# Altium schematic sheet Regulators.SchDoc
size Letter; ProjectTitle: Dan DfMux Mezz; ModelNumber: MGMEZZ04
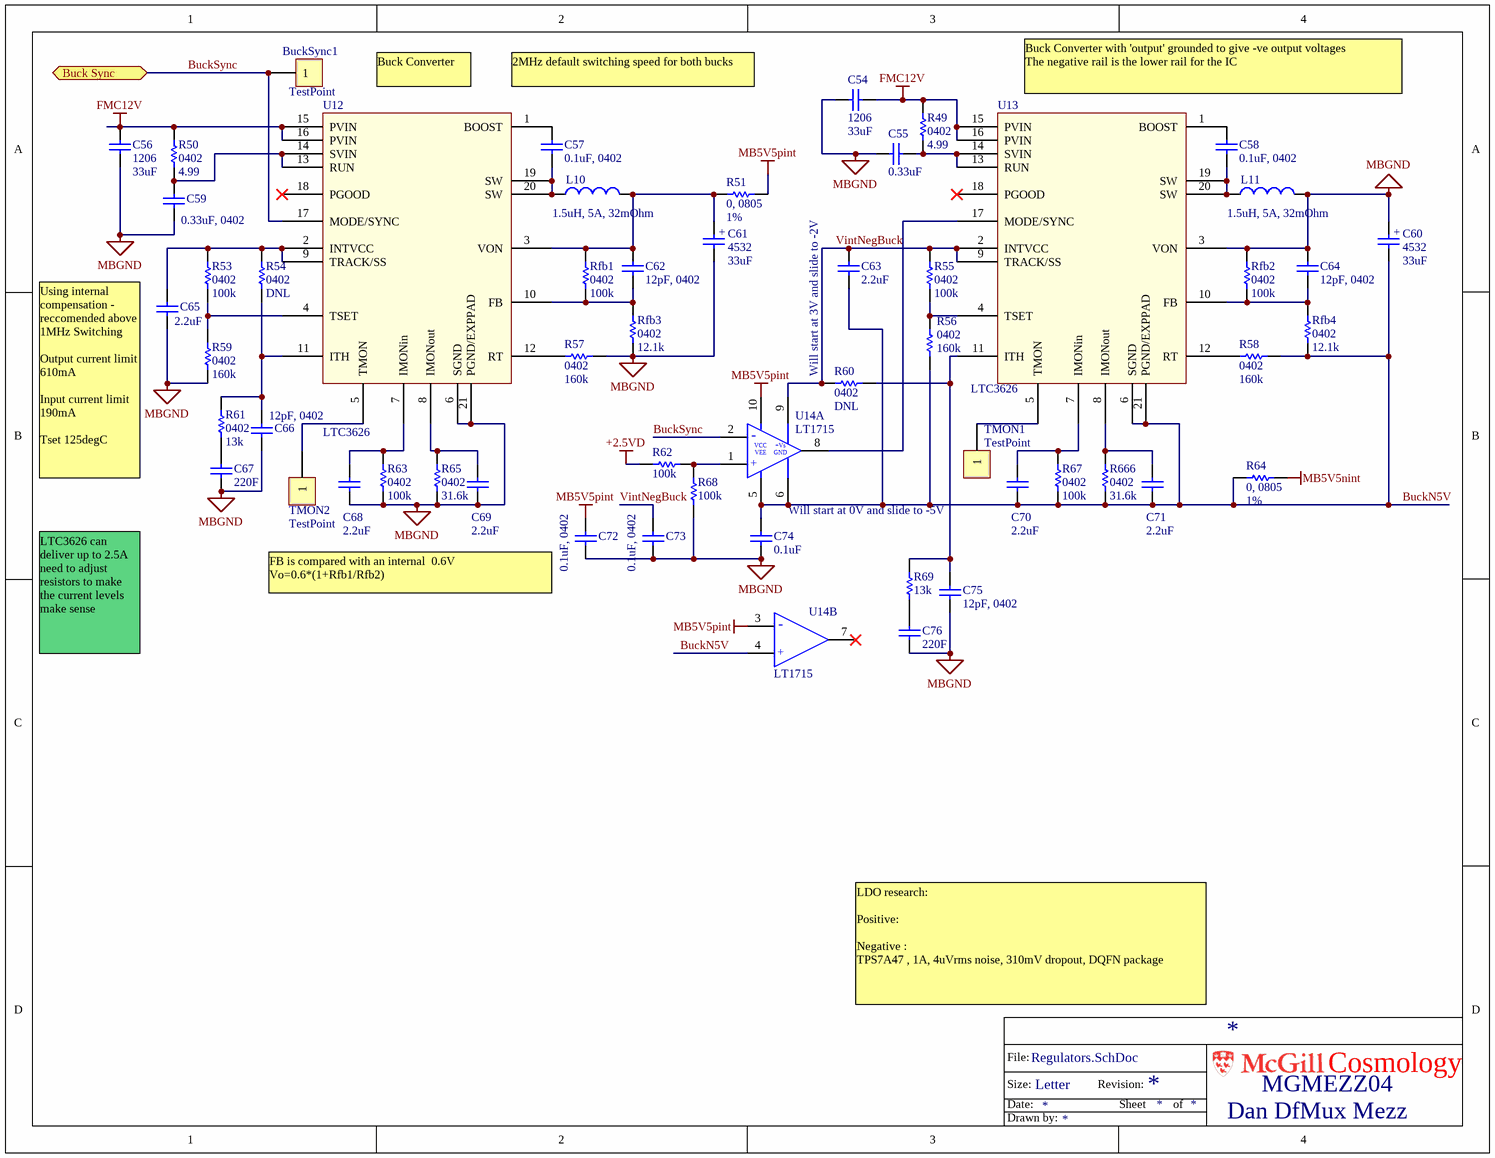
[diagram p0: Regulators.SchDoc]

## Parts
BuckSync1  TestPoint  [TP-3520-SK]  (no BOM)
C54  Footprint: 1206  [CC3225-1210]  (hidden comment: 33uF)
C55  0.33uF  [0603]
C56  Footprint: 1206  [CC3225-1210]  (hidden comment: 33uF)
C57  0.1uF, 0402  [0402]
C58  0.1uF, 0402  [0402]
C59  0.33uF, 0402  [0402]
C60  Footprint: 4532  [TANT4532]  (hidden comment: 33uF)
C61  Footprint: 4532  [TANT4532]  (hidden comment: 33uF)
C62  12pF, 0402  [0402]
C63  2.2uF  [0603]
C64  12pF, 0402  [0402]
C65  2.2uF  [0603]
C66  12pF, 0402  [0402]
C67  220F  [0603]
C68  2.2uF  [0603]
C69  2.2uF  [0603]
C70  2.2uF  [0603]
C71  2.2uF  [0603]
C72  0.1uF, 0402  [0402]
C73  0.1uF, 0402  [0402]
C74  0.1uF  [0603]
C75  12pF, 0402  [0402]
C76  220F  [0603]
L10  Part Constraints: 1.5uH, 5A, 32mOhm  [IHLP-1212]  (hidden comment: 1.5uH)
L11  Part Constraints: 1.5uH, 5A, 32mOhm  [IHLP-1212]  (hidden comment: 1.5uH)
R49  4.99  [0402]
R50  4.99  [0402]
R51  0, 0805  Param: 1%  [0805]
R53  100k  [0402]
R54  DNL  [0402]
R55  100k  [0402]
R56  160k  [0402]
R57  160k  [0402]
R58  160k  [0402]
R59  160k  [0402]
R60  DNL  [0402]
R61  13k  [0402]
R62  100k  [0603]
R63  100k  [0402]
R64  0, 0805  Param: 1%  [0805]
R65  31.6k  [0402]
R67  100k  [0402]
R68  100k  [0603]
R69  13k  [0603]
R666  31.6k  [0402]
Rfb1  100k  [0402]
Rfb2  100k  [0402]
Rfb3  12.1k  [0402]
Rfb4  12.1k  [0402]
TMON1  TestPoint  [TP-3520-SK]  (no BOM)
TMON2  TestPoint  [TP-3520-SK]  (no BOM)
U12  LTC3626  [LTC3626]
U13  LTC3626  [LTC3626]
U14  LT1715  [TSSOP50P490X110-10N]  (parts A,B of 2)

## Ports
Buck Sync

## Nets
+2.5VD: R62.2
FMC12V: C54.1 C56.1 R49.1 R50.1 U12.15(PVIN) U12.16(PVIN) U13.15(PVIN) U13.16(PVIN)
MB5V5nint: R64.1
MB5V5pint: C72.2 R51.1 U14.3(-) U14.10(Vcc)
MBGND: C54.2 C55.1 C56.2 C59.1 C60.1 C61.2 C64.2 C65.1 C66.1 C67.2 C68.2 C69.2 C72.1 C73.1 C74.1 C75.1 C76.2 L11.2 R57.2 R59.2 R63.2 R65.2 R68.2 Rfb2.1 Rfb3.2 U12.6(SGND) U12.21(PGND/EXPPAD) U13.3(VON)
BuckN5V: C60.2 C63.1 C70.2 C71.2 C74.2 R56.2 R58.2 R64.2 R67.2 R666.2 Rfb4.2 U13.6(SGND) U13.21(PGND/EXPPAD) U14.4(+) U14.5(Vee) U14.6(Gnd)
BuckSync: BuckSync1.1 U12.17(MODE/SYNC) U14.2(-) ; port Buck Sync
VintNegBuck: C63.2 C73.2 R55.1 R60.1 U13.2(INTVCC) U13.9(TRACK/SS) U14.9(Vs)
NetC55_2: C55.2 R49.2 U13.13(RUN) U13.14(SVIN)
NetC57_1: C57.1 L10.1 U12.19(SW) U12.20(SW)
NetC57_2: C57.2 U12.1(BOOST)
NetC58_1: C58.1 L11.1 U13.19(SW) U13.20(SW)
NetC58_2: C58.2 U13.1(BOOST)
NetC59_2: C59.2 R50.2 U12.13(RUN) U12.14(SVIN)
NetC61_1: C61.1 C62.2 L10.2 R51.2 Rfb1.1 U12.3(VON)
NetC62_1: C62.1 Rfb1.2 Rfb3.1 U12.10(FB)
NetC64_1: C64.1 Rfb2.2 Rfb4.1 U13.10(FB)
NetC65_2: C65.2 R53.1 R54.1 U12.2(INTVCC) U12.9(TRACK/SS)
NetC66_2: C66.2 R54.2 R61.1 U12.11(ITH)
NetC67_1: C67.1 R61.2
NetC68_1: C68.1 R63.1 U12.7(IMONin)
NetC69_1: C69.1 R65.1 U12.8(IMONout)
NetC70_1: C70.1 R67.1 U13.7(IMONin)
NetC71_1: C71.1 R666.1 U13.8(IMONout)
NetC75_2: C75.2 R60.2 R69.2 U13.11(ITH)
NetC76_1: C76.1 R69.1
NetR53_2: R53.2 R59.1 U12.4(TSET)
NetR55_2: R55.2 R56.1 U13.4(TSET)
NetR57_1: R57.1 U12.12(RT)
NetR58_1: R58.1 U13.12(RT)
NetR62_1: R62.1 R68.1 U14.1(+)
NetTMON1_1: TMON1.1 U13.5(TMON)
NetTMON2_1: TMON2.1 U12.5(TMON)
NetU13_17: U13.17(MODE/SYNC) U14.8(Out)

Not connected (* = marked no-connect by the designer): U12 18(PGOOD)*; U13 18(PGOOD)*; U14 7(Out)*

## Notes on the sheet
- (near U12) Buck Converter
- 2MHz default switching speed for both bucks
- Buck Converter with 'output' grounded to give -ve output voltages
  The negative rail is the lower rail for the IC
- (near R60) Will start at 3V and slide to -2V
- (near C65) Using internal compensation - reccomended above 1MHz Switching
  Output current limit 610mA
  Input current limit 190mA
  Tset 125degC
- Will start at 0V and slide to -5V
- (near C72) FB is compared with an internal  0.6V
  Vo=0.6*(1+Rfb1/Rfb2)
- LTC3626 can deliver up to 2.5A need to adjust resistors to make the current levels make sense
- LDO research:
  Positive:
  Negative :
  TPS7A47 , 1A, 4uVrms noise, 310mV dropout, DQFN package
- File:
- Size:
- Date:
- Letter
- Revision:
- Sheet
- of
- Cosmology
- Drawn by:
- (in symbol CAP4532) +
- (in symbol LT1715, part A) VCC; +Vs; VEE; GND

## Library data of the parts
BuckSync1 TMON1 TMON2 = TestPoint: TestPoint1; Assembly Comments: none; Footprint: *; Type: Test Point; SupplierUnitCost: 0
C54 C56 = CAP 1210: Capacitor, Ceramic, 1210; Manufacturer: TDK Corporation; Part Constraints: 33uF or 47uF  (1206 or 1210) 25V X5R; Manufacturers Part Number: C3216X5R1E336M; Assembly Comments: none; Type: Capacitor; SupplierUnitCost: $1.1; Value: 33uF; Supplier 1: Digi-Key; Supplier Part Number 1: 445-8046-1-ND
C55 C67 C74 C76 = CAP 0603: Capacitor, Ceramic, 0603; Part Constraints: 10% 16V X7R 0603; Manufacturer: Generic; Assembly Comments: none; Manufacturers Part Number: Generic; Type: Capacitor; SupplierUnitCost: 0
  C55: Value: 0.33uF
  C67 C76: Value: 220F
  C74: Value: 0.1uF
C57 C58 C72 C73 = CAP 0603: Capacitor, Ceramic, 0402; Part Constraints: 10% 10V X5R 0402; Manufacturer: Generic; Manufacturer 1: TDK Corporation; Manufacturer Part Number 1: C1005X5R1A104K050BA; Description 1: CAP CER 0.1UF 10V 10% X5R 0402; Category 1: Capacitors; Capacitance: 0.1µF; Voltage - Rated: 10V; Tolerance: ±10%; Temperature Coefficient: X5R; Manufacturers Part Number: Generic; Value: 0.1uF, 0402; Type: Capacitor; SupplierUnitCost: 0; Supplier 1: Digi-Key; Supplier Part Number 1: 445-1265-1-ND; RoHS 1: RoHS Compliant; Stock 1: 1761268; Pricing 1: 1=0.11, 10=0.028, 100=0.0129, 250=0.01048, 500=0.00898, 1000=0.00699, 5000=0.00583 (CAD); Mounting Type: Surface Mount, MLCC; Operating Temperature: -55°C ~ 85°C; Applications: General Purpose; Ratings: -; Package / Case: 0402 (1005 Metric); Size / Dimension: 0.039" L x 0.020" W (1.00mm x 0.50mm); Height - Seated (Max): -; Thickness (Max): 0.022" (0.55mm); Lead Spacing: -; Features: -; Packaging: Cut Tape (CT); Lead Style: -; ComponentLink1URL: http://product.tdk.com/capacitor/mlcc/en/documents/mlcc_commercial_general_en.pdf; ComponentLink1Description: http://product.tdk.com/capacitor/mlcc/en/documents/mlcc_commercial_general_en.pdf
C59 = CAP 0603: Capacitor, Ceramic, 0402; Part Constraints: 10% 10V X5R 0402; Manufacturer: Generic; Manufacturer 1: TDK Corporation; Manufacturer Part Number 1: C1005X5R1A334K050BB; Description 1: CAP CER 0.33UF 10V 10% X5R 0402; Category 1: Capacitors; Capacitance: 0.33µF; Voltage - Rated: 10V; Tolerance: ±10%; Temperature Coefficient: X5R; Manufacturers Part Number: Generic; Value: 0.33uF, 0402; Type: Capacitor; SupplierUnitCost: 0; RoHS 1: RoHS Compliant; Stock 1: 13532; Pricing 1: 1=0.13, 10=0.092, 100=0.0421, 250=0.03444, 500=0.02948, 1000=0.02296, 5000=0.01913 (CAD); Mounting Type: Surface Mount, MLCC; Operating Temperature: -55°C ~ 85°C; Applications: General Purpose; Ratings: -; Package / Case: 0402 (1005 Metric); Size / Dimension: 0.039" L x 0.020" W (1.00mm x 0.50mm); Height - Seated (Max): -; Thickness (Max): 0.022" (0.55mm); Lead Spacing: -; Features: -; Packaging: Cut Tape (CT); Lead Style: -; Supplier 1: Digi-Key; Supplier Part Number 1: 445-4987-6-ND; ComponentLink1URL: http://product.tdk.com/capacitor/mlcc/en/documents/mlcc_commercial_general_en.pdf; ComponentLink1Description: http://product.tdk.com/capacitor/mlcc/en/documents/mlcc_commercial_general_en.pdf
C60 C61 = CAP4532: 33u, 16V, 20%, 4532C, X5R; Manufacturer: TDK Corporation; Manufacturers Part Number: C4532X5R1C336M; Type: Capacitor; Assembly Comments: none; Part Constraints: 33u, 16V, 20%, 4532C, X5R; SupplierUnitCost: $1.30; Supplier 1: Digi-Key; Supplier Part Number 1: 445-1443-1-ND; Value: 33uF
C62 C64 C66 C75 = CAP 0402: Capacitor, Ceramic, 0603; Part Constraints: 10% 16V X7R 0402; Manufacturer: Generic; Assembly Comments: none; Manufacturers Part Number: Generic; Type: Capacitor; SupplierUnitCost: 0; Value: 12pF, 0402
C63 C65 = CAP 0603: Capacitor, Ceramic, 0603; Part Constraints: 10% 10V X5R 0603; Manufacturer: Generic; Assembly Comments: none; Manufacturers Part Number: Generic; Type: Capacitor; SupplierUnitCost: 0; Value: 2.2uF
C68-C71 = CAP 0603: Capacitor, Ceramic, 0603; Part Constraints: 10% 6.3V X5R 0603; Manufacturer: Generic; Manufacturer 1: TDK Corporation; Manufacturer Part Number 1: C1608X5R0J225K080AB; Assembly Comments: none; Description 1: CAP CER 2.2UF 6.3V 10% X5R 0603; Category 1: Capacitors; Capacitance: 2.2µF; Voltage - Rated: 6.3V; Tolerance: ±10%; Temperature Coefficient: X5R; Manufacturers Part Number: Generic; Value: 2.2uF; Type: Capacitor; SupplierUnitCost: 0; Supplier 1: Digi-Key; Supplier Part Number 1: 445-5175-1-ND; RoHS 1: RoHS Compliant; Stock 1: 82331; Pricing 1: 1=0.18, 10=0.122, 100=0.0581, 250=0.04884, 500=0.04092, 1000=0.03358 (CAD); Mounting Type: Surface Mount, MLCC; Operating Temperature: -55°C ~ 85°C; Applications: General Purpose; Ratings: -; Package / Case: 0603 (1608 Metric); Size / Dimension: 0.063" L x 0.031" W (1.60mm x 0.80mm); Height - Seated (Max): -; Thickness (Max): 0.037" (0.95mm); Lead Spacing: -; Features: -; Packaging: Cut Tape (CT); Lead Style: -; ComponentLink1URL: http://product.tdk.com/capacitor/mlcc/en/documents/mlcc_commercial_general_en.pdf; ComponentLink1Description: http://product.tdk.com/capacitor/mlcc/en/documents/mlcc_commercial_general_en.pdf
L10 L11 = IND IHLP1212: Inductor IHLP1212; Manufacturer: Vishay Dale; Manufacturers Part Number: IHLP1212BZER1R5M11; Assembly Comments: none; Footprint: IHLP1212; Type: Inductor; SupplierUnitCost: $1.30; Value: 1.5uH; Supplier 1: Digi-Key; Supplier Part Number 1: 541-1321-1-ND
R49 R50 R53-R61 R63 R65 R67 R666 Rfb1-Rfb4 = RES 0402: Resistor; Manufacturer: Generic; Part Constraints: 1% 1/10W 100ppm 0402; Assembly Comments: none; Manufacturers Part Number: Generic; Type: Resistor; SupplierUnitCost: 0
  R49 R50: Value: 4.99
  R53 R55 R63 R67 Rfb1 Rfb2: Value: 100k
  R54 R60: Value: DNL
  R56-R59: Value: 160k
  R61: Value: 13k
  R65 R666: Value: 31.6k
  Rfb3 Rfb4: Value: 12.1k
R51 R64 = Res1812: RES 0.0 OHM 1/8W 0805 SMD; Manufacturers P/N: e.g CRCW08050000Z0EAHP; Manufacturer: e.g Vishay/Dale; Part constraints: 0Ohm jumper, >=4A, 0805, <=5mOhms; Param1: 200ppm/C; Value: 0; CanPurchaseFrom: Newark
R62 R68 R69 = RES 0603: Resistor; Manufacturer: Generic; Part Constraints: 1% 1/10W 100ppm 0603; Assembly Comments: none; Manufacturers Part Number: Generic; Type: Resistor; SupplierUnitCost: 0
  R62 R68: Value: 100k
  R69: Value: 13k
U12 U13 = LTC3626: 20V, 2.5A Sync buck, 3Mhz; Part Constraints: LTC3626EUDC#PBF; Manufacturer: Linear Technology; Assembly Comments: none; Supplier 1: Digi-Key; Supplier Part Number 1: LTC3626EUDC#PBF-ND; Manufacturers Part Number: LTC3626EUDC#PBF; Type: IC; SupplierUnitCost: $8.10
U14 = LT1715: Comparator with two supplies; Manufacturer 1: Linear Technology; Manufacturer Part Number 1: LT1715IMS#PBF; Description 1: IC COMPARATOR 150MHZ DUAL 10MSOP; Category 1: Integrated Circuits (ICs); Number of Elements: 2; Output Type: CMOS, Rail-to-Rail, TTL; Voltage - Supply, Single/Dual (±): 2.7 V ~ 12 V; Voltage - Input Offset (Max): 2.5mV @ ±5V; Current - Input Bias (Max): 6µA @ ±5V; Current - Output (Typ): 20mA; Current - Quiescent (Max): 2mA; CMRR, PSRR (Typ): 70dB CMRR, 80dB PSRR; Propagation Delay (Max): 9ns; Hysteresis: 6mV; Supplier 1: Digi-Key; RoHS 1: RoHS Compliant; Stock 1: 197; Pricing 1: 1=8.65, 25=5.7412, 100=4.5517 (CAD); Type: General Purpose; Operating Temperature: -40°C ~ 85°C; Package / Case: 10-TFSOP, 10-MSOP (0.118", 3.00mm Width); Mounting Type: Surface Mount; Packaging: Tube; Supplier Device Package: 10-MSOP; ComponentLink1URL: http://www.linear.com/docs/2821; ComponentLink1Description: http://www.linear.com/docs/2821; Supplier Part Number 1: LT1715IMS#PBF-ND